# EAGLE board TMCM-1110_V21_eagle (EAGLE 6.5.0)
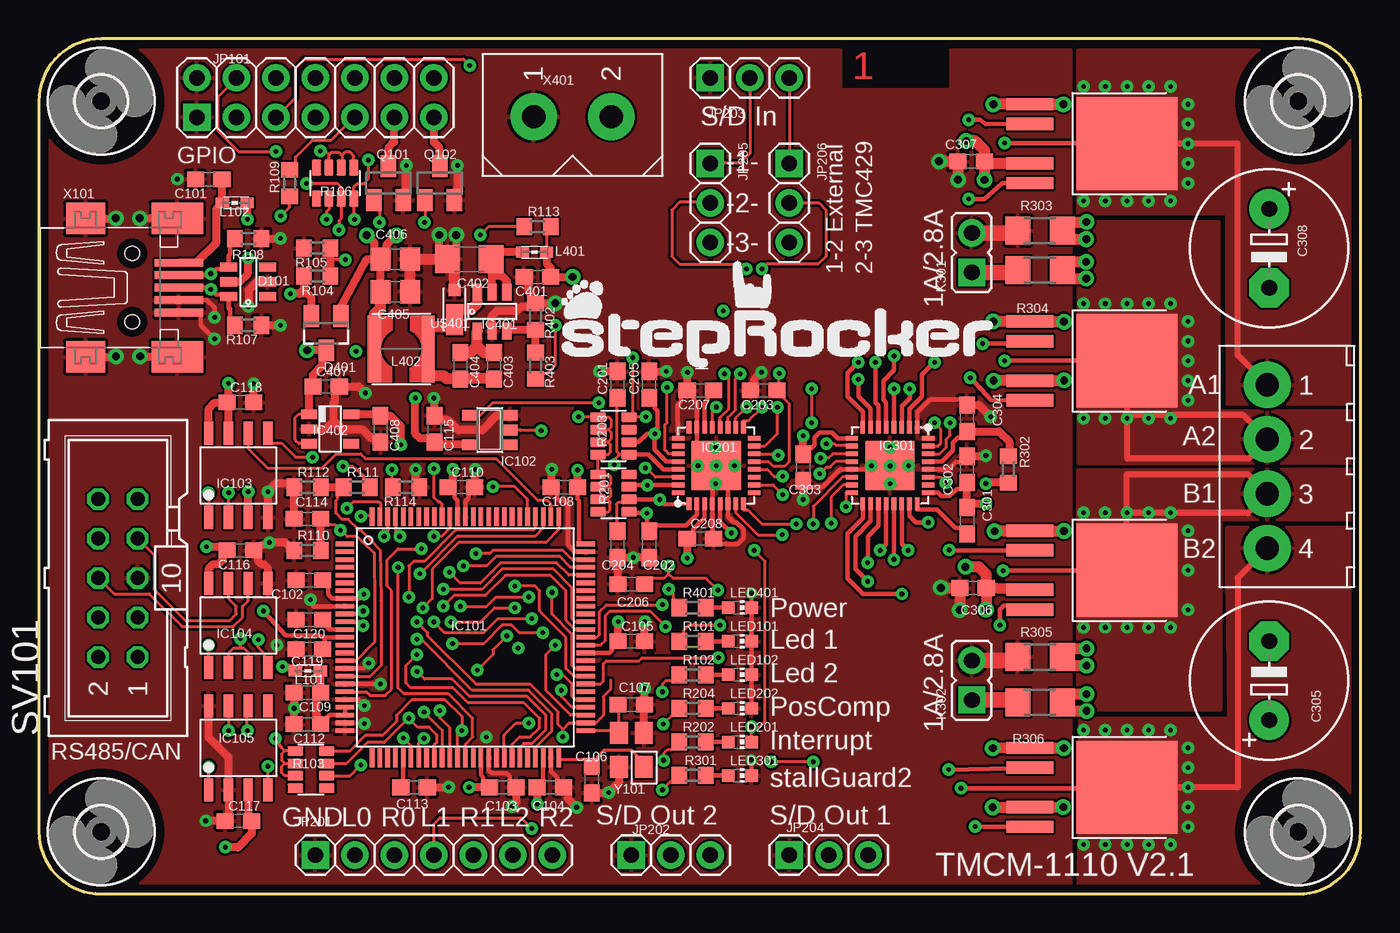
[diagram p4: board, top side]
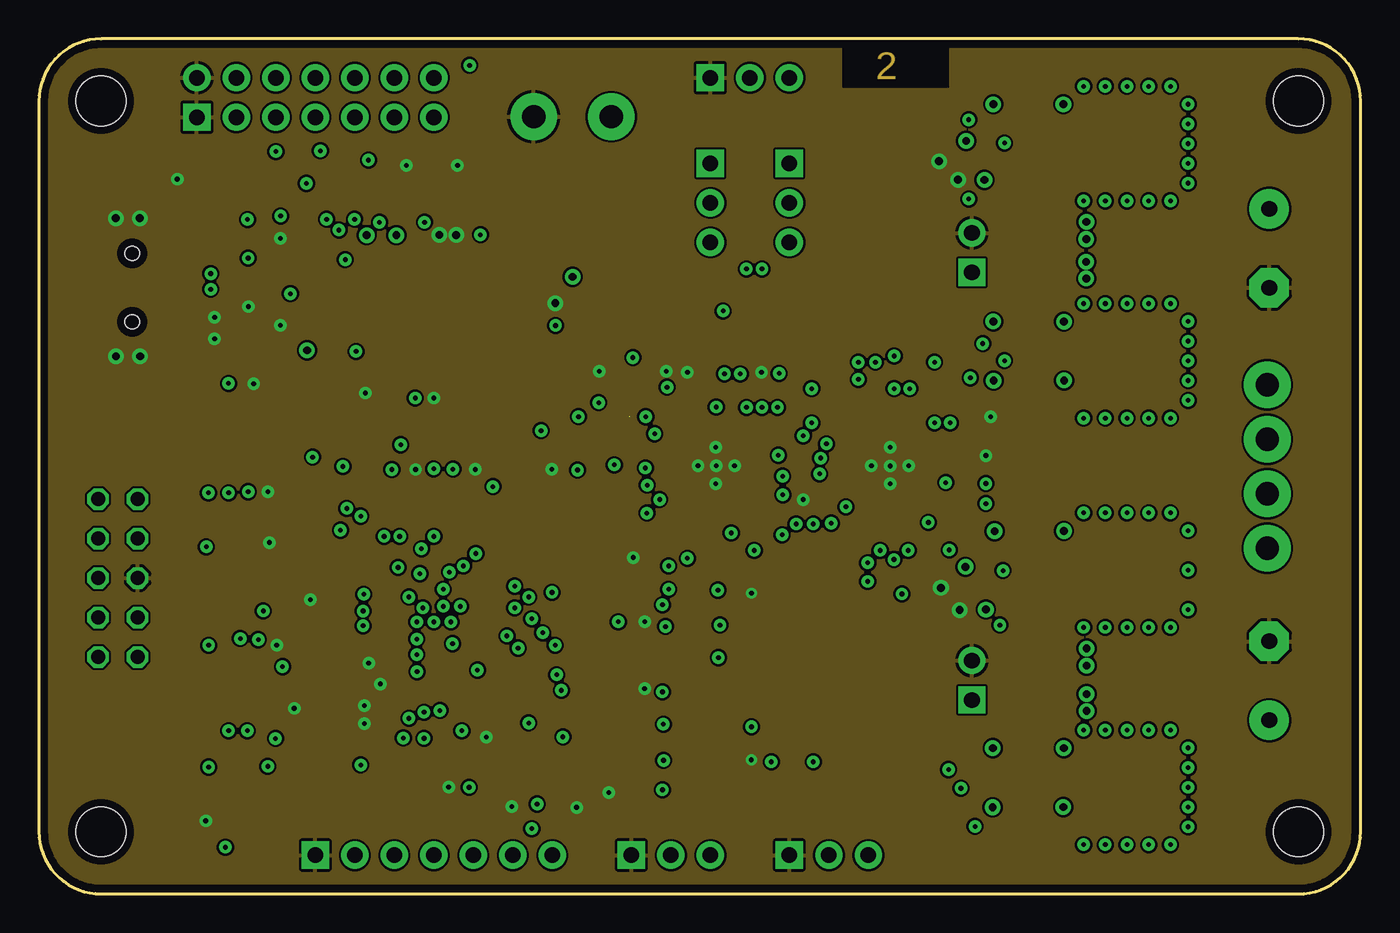
[diagram p5: board, inner layer Layer2]
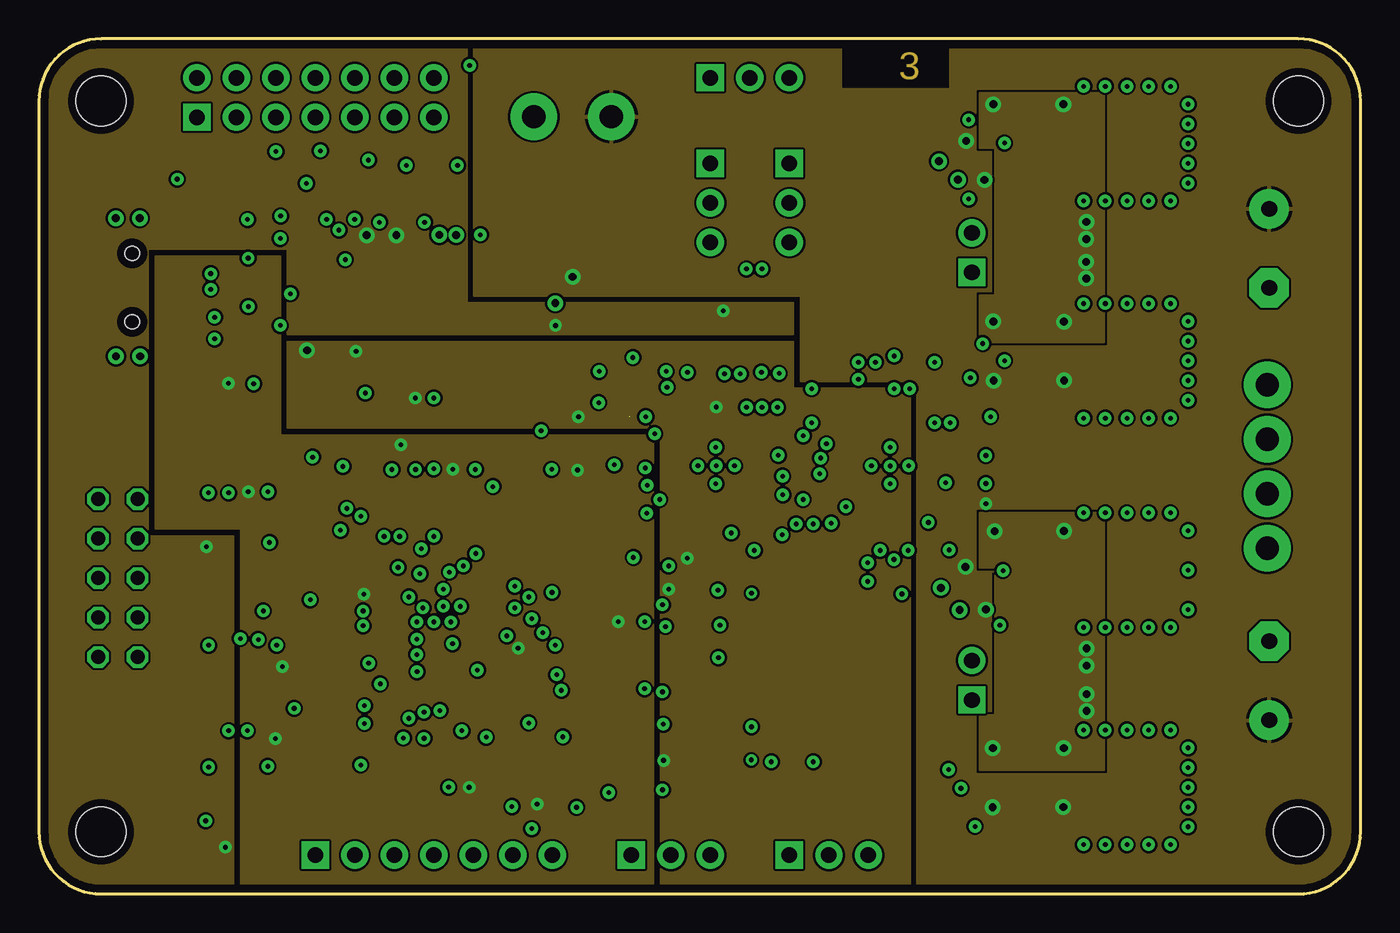
[diagram p6: board, inner layer Route15]
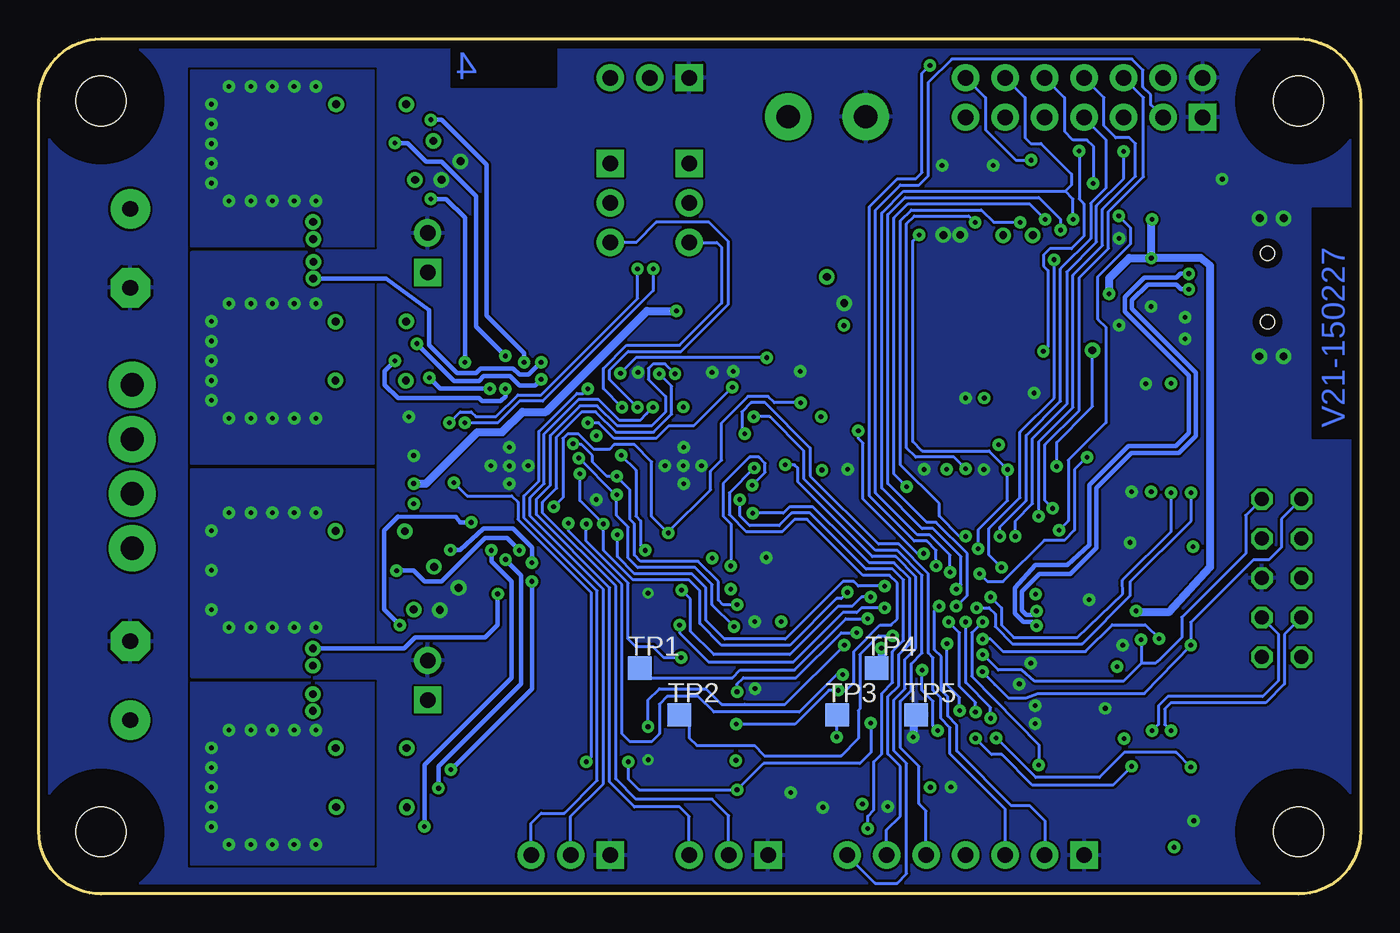
[diagram p7: board, bottom side, seen from below]

Size 85 x 55 mm. Coordinates in mm from the lower left corner, seen from the top.
Outline: 0,51 0,4 arc90 4,0 81,0 arc90 85,4 85,51 arc90 81,55 4,55 arc90 0,51
Copper layers ((1+2)*(15+16)): Top 0.035mm / dielectric 0.36mm / Layer2 0.035mm / dielectric 0.71mm / Route15 0.035mm / dielectric 0.36mm / Bottom 0.035mm
Design rules "default": minimum track width 0.15mm, minimum drill 0.3mm, track to track 0.15mm, track to pad 0.15mm, pad to pad 0.15mm, via to via 0.15mm, smd to smd 0.15mm, copper to edge 0.5mm, drill to drill 0.3mm, minimum pad ring 0.15mm, minimum via ring 0.2mm, stop-mask expansion 0mil, vias tented up to drill 0.5mm, thermal gap 0.2mm
Net classes: 0 default: clearance 0.15 mm

## Footprints (pad centres in the part's own frame; a part is rotated, then mirrored left to right if it is on the bottom)
C0603 = smd 1.1 x 1: 1 -0.85,0; 2 0.85,0
0603 = smd 1.1 x 1: 1 -0.85,0; 2 0.85,0
E5-10,5 = drill 1.016 pad 2.54: + -2.54,0 | drill 1.016 pad 2.54 octagon: - 2.54,0
C1206 = smd 1.6 x 1.8: 1 -1.4,0; 2 1.4,0
C0805 = smd 1.3 x 1.5: 1 -0.95,0; 2 0.95,0
TMC_SOT23-6 = smd 0.6 x 1.1: 1 -0.95,-1.25; 2 0,-1.25; 3 0.95,-1.25; 4 0.95,1.25; 5 0,1.25; 6 -0.95,1.25
SOT23 = smd 1 x 1.4: 1 -0.95,-1.1; 2 0.95,-1.1; 3 0,1.1
3,2 = hole 3.2: 0,0
TMC_LQFP100 = smd 0.3 x 1.2: 1 -6,-7.75; 2 -5.5,-7.75; 3 -5,-7.75; 4 -4.5,-7.75; 5 -4,-7.75; 6 -3.5,-7.75; 7 -3,-7.75; 8 -2.5,-7.75; 9 -2,-7.75; 10 -1.5,-7.75; 11 -1,-7.75; 12 -0.5,-7.75; 13 0,-7.75; 14 0.5,-7.75; 15 1,-7.75; 16 1.5,-7.75; 17 2,-7.75; 18 2.5,-7.75; 19 3,-7.75; 20 3.5,-7.75; 21 4,-7.75; 22 4.5,-7.75; 23 5,-7.75; 24 5.5,-7.75; 25 6,-7.75; 51 6,7.75; 52 5.5,7.75; 53 5,7.75; 54 4.5,7.75; 55 4,7.75; 56 3.5,7.75; 57 3,7.75; 58 2.5,7.75; 59 2,7.75; 60 1.5,7.75; 61 1,7.75; 62 0.5,7.75; 63 0,7.75; 64 -0.5,7.75; 65 -1,7.75; 66 -1.5,7.75; 67 -2,7.75; 68 -2.5,7.75; 69 -3,7.75; 70 -3.5,7.75; 71 -4,7.75; 72 -4.5,7.75; 73 -5,7.75; 74 -5.5,7.75; 75 -6,7.75 | smd 1.2 x 0.3: 26 7.75,-6; 27 7.75,-5.5; 28 7.75,-5; 29 7.75,-4.5; 30 7.75,-4; 31 7.75,-3.5; 32 7.75,-3; 33 7.75,-2.5; 34 7.75,-2; 35 7.75,-1.5; 36 7.75,-1; 37 7.75,-0.5; 38 7.75,0; 39 7.75,0.5; 40 7.75,1; 41 7.75,1.5; 42 7.75,2; 43 7.75,2.5; 44 7.75,3; 45 7.75,3.5; 46 7.75,4; 47 7.75,4.5; 48 7.75,5; 49 7.75,5.5; 50 7.75,6; 78 -7.75,5; 79 -7.75,4.5; 80 -7.75,4; 81 -7.75,3.5; 82 -7.75,3; 83 -7.75,2.5; 84 -7.75,2; 85 -7.75,1.5; 86 -7.75,1; 87 -7.75,0.5; 88 -7.75,0; 89 -7.75,-0.5; 90 -7.75,-1; 91 -7.75,-1.5; 92 -7.75,-2; 93 -7.75,-2.5; 94 -7.75,-3; 95 -7.75,-3.5; 96 -7.75,-4; 97 -7.75,-4.5; 98 -7.75,-5; 99 -7.75,-5.5; 100 -7.75,-6 | smd 1.2 x 0.29: 76 -7.75,6; 77 -7.75,5.5
SOT23-5 = smd 0.69 x 0.99: 1 -0.95,-1.29; 2 0,-1.29; 3 0.95,-1.29; 4 0.95,1.3; 5 -0.95,1.3
SO8 = smd 1.5 x 0.6: 1 -2.7,1.905; 2 -2.7,0.635; 3 -2.7,-0.635; 4 -2.7,-1.905; 5 2.7,-1.905; 6 2.7,-0.635; 7 2.7,0.635; 8 2.7,1.905
QFN32_5X5 = smd 0.8 x 0.3: 1 -2.45,1.75; 2 -2.45,1.25; 3 -2.45,0.75; 4 -2.45,0.25; 5 -2.45,-0.25; 6 -2.45,-0.75; 7 -2.45,-1.25; 8 -2.45,-1.75; 17 2.45,-1.75; 18 2.45,-1.25; 19 2.45,-0.75; 20 2.45,-0.25; 21 2.45,0.25; 22 2.45,0.75; 23 2.45,1.25; 24 2.45,1.75 | smd 0.3 x 0.8: 9 -1.75,-2.45; 10 -1.25,-2.45; 11 -0.75,-2.45; 12 -0.25,-2.45; 13 0.25,-2.45; 14 0.75,-2.45; 15 1.25,-2.45; 16 1.75,-2.45; 25 1.75,2.45; 26 1.25,2.45; 27 0.75,2.45; 28 0.25,2.45; 29 -0.25,2.45; 30 -0.75,2.45; 31 -1.25,2.45; 32 -1.75,2.45 | smd 3.2 x 3.2: EXP 0,0
SOT23-5' = smd 0.6 x 1.05: 1 -0.95,-1.35; 2 0,-1.35; 3 0.95,-1.35; 4 0.95,1.35; 5 -0.95,1.35
2X07 = drill 1 pad 1.75 square: 1 -7.62,-1.27 | drill 1 pad 1.75: 2 -7.62,1.27; 3 -5.08,-1.27; 4 -5.08,1.27; 5 -2.54,-1.27; 6 -2.54,1.27; 7 0,-1.27; 8 0,1.27; 9 2.54,-1.27; 10 2.54,1.27; 11 5.08,-1.27; 12 5.08,1.27; 13 7.62,-1.27; 14 7.62,1.27
1X07 = drill 1 pad 1.75 square: 1 -7.62,0 | drill 1 pad 1.75: 2 -5.08,0; 3 -2.54,0; 4 0,0; 5 2.54,0; 6 5.08,0; 7 7.62,0
1X03 = drill 1 pad 1.75 square: 1 -2.54,0 | drill 1 pad 1.75: 2 0,0; 3 2.54,0
JP1 = drill 1 pad 1.75 square: 1 0,-1.27 | drill 1 pad 1.75: 2 0,1.27
0603' = smd 0.85 x 0.7: 1 -0.9,0; 2 0.7,0
0603'' = smd 0.85 x 0.7: 1 -0.775,0; 2 0.775,0
WE-TPC_3816 = smd 0.85 x 4.3: 1 -1.731,0; 2 1.731,0
CHIP-LED0603 = smd 0.8 x 0.8: A 0,-0.75; C 0,0.75
R0603 = smd 1 x 1.1: 1 -0.85,0; 2 0.85,0
R_4X_1206 = smd 0.6 x 1: P$1 -1.2,-1; P$2 -0.4,-1; P$3 0.4,-1; P$4 1.2,-1; P$5 1.2,1; P$6 0.4,1; P$7 -0.4,1; P$8 -1.2,1
R1206 = smd 1.6 x 1.803: 1 -1.422,0; 2 1.422,0
ML10 = drill 0.914 octagon: 1 -5.08,-1.27; 2 -5.08,1.27; 3 -2.54,-1.27; 4 -2.54,1.27; 5 0,-1.27; 6 0,1.27; 7 2.54,-1.27; 8 2.54,1.27; 9 5.08,-1.27; 10 5.08,1.27
DUAL_DPAK_4L = smd 3 x 0.8: 1 -6.25,2.54; 2 -6.25,1.27; 4 -6.25,-1.27; 5 -6.25,-2.54 | smd 6.5 x 6: 3 0,0
TP15SQ = smd 1.5 x 1.5: TP 0,0
MICRO_SMP = smd 0.8 x 0.8: A 1.25,0 | smd 2 x 1.1: C -0.65,0
32005-301 = smd 3.1 x 0.5: 1 3,1.6; 2 3,0.8; 3 3,0; 4 3,-0.8; 5 3,-1.6 | smd 2.5 x 2: M1 -3,-4.45; M2 -3,4.45 | smd 3.3 x 2: M3 2.9,4.45; M4 2.9,-4.45 | hole 0.9: 0,2.2; 0,-2.2
RIACONNECT_183-04 = drill 1.5 pad 3: 1 0,5.25; 2 0,1.75; 3 0,-1.75; 4 0,-5.25
RIACONNECT_320-02 = drill 1.5 pad 3: 1 0,2.5; 2 0,-2.5
MYLIB_FA-238 = smd 1.4 x 1.15: 1 -1.1,-0.8; 2 1.1,-0.8; 3 1.1,0.8; 4 -1.1,0.8

## Placement (x,y rotation side)
C101  10nF/16V  [C0603]  10.92,45.97 180 top
C102  100nF/50V  [C0603]  17.4,20.19 180 top
C103  100nF/50V  [C0603]  29.84,6.86 0 top
C104  100nF/50V  [C0603]  32.89,6.86 0 top
C105  100nF/50V  [C0603]  38.1,16.26 0 top
C106  0603/15p/10v  [0603]  35.56,7.37 90 top
C107  0603/15p/10v  [0603]  38.1,12.19 180 top
C108  100nF/50V  [C0603]  33.78,26.16 180 top
C109  2.2µF/10V  [C0603]  17.27,12.95 180 top
C110  100nF/50V  [C0603]  27.18,26.16 0 top
C112  100nF/16V  [C0603]  17.27,10.92 180 top
C113  100nF/50V  [C0603]  24.13,6.86 0 top
C114  100nF/16V  [C0603]  17.27,24.13 180 top
C115  100nF/50V  [C0603]  25.45,29.91 270 top
C116  100nF/50V  [C0603]  12.95,22.1 180 top
C117  100nF/50V  [C0603]  12.83,4.7 0 top
C118  100nF/50V  [C0603]  12.95,31.62 0 top
C119  2.2µF/10V  [C0603]  17.4,15.75 180 top
C120  2.2µF/10V  [C0603]  17.4,17.65 180 top
C201  100nF  [C0603]  37.21,32.77 90 top
C202  100nF  [C0603]  39.24,22.48 270 top
C203  100nF  [C0603]  46.61,32.38 180 top
C204  100nF  [C0603]  37.21,22.48 270 top
C205  100nF  [C0603]  39.24,32.77 90 top
C206  100nF  [C0603]  38.1,19.94 180 top
C207  470nF  [C0603]  42.55,32.38 180 top
C208  100nF  [C0603]  42.55,22.86 0 top
C301  220nF 16V  [C0603]  59.69,24 270 top
C302  100nF 50V  [C0603]  59.69,27.3 90 top
C303  470nF 16V  [C0603]  49.15,27.43 270 top
C304  100nF 50V  [C0603]  59.69,30.61 90 top
C305  220µF 50V  [E5-10,5]  79.12,13.72 90 top
C306  100nF 50V  [C0603]  60.07,19.68 180 top
C307  100nF 50V  [C0603]  59.94,47.12 180 top
C308  220µF 50V  [E5-10,5]  79.12,41.53 270 top
C401  100nF/50V  [C0603]  32.07,39.69 180 top
C402  2.2µF/50V/1206  [C1206]  27.69,40.83 180 top
C403  100nF/16V  [C0603]  29.27,33.97 270 top
C404  100nF/16V  [C0603]  27.11,33.97 270 top
C405  22uF/6V3  [C0805]  22.92,38.73 0 top
C406  22uF/6V3  [C0805]  22.92,40.83 0 top
C407  4.7µF/10V  [C0603]  18.48,32.64 0 top
C408  4.7µF/10V  [C0603]  21.97,29.91 270 top
D101  SRV05-4  [TMC_SOT23-6]  13.46,39.37 90 top
D401  BAS40-05  [SOT23]  18.48,36.07 180 top
DRILEGEND  [DRILEGEND]  91.45,52.07 0 top  (outside the outline)
H401  MOUNT-HOLE3.2  [3,2]  81,4 0 top
H402  MOUNT-HOLE3.2  [3,2]  81,51 0 top
H403  MOUNT-HOLE3.2  [3,2]  4,51 0 top
H404  MOUNT-HOLE3.2  [3,2]  4,4 0 top
IC101  MK20DX256VLL10  [TMC_LQFP100]  27.43,16.51 270 top
IC102  74AHCT1G14DBV  [SOT23-5]  29,29.84 90 top
IC103  AT25128B  [SO8]  12.83,26.92 90 top
IC104  SN65HVD3082ED  [SO8]  12.83,17.27 90 top
IC105  TJA1050T  [SO8]  12.83,9.4 90 top
IC201  TMC429-LI  [QFN32_5X5]  43.56,27.56 90 top
IC301  TMC262-LA  [QFN32_5X5]  54.74,27.56 270 top
IC401  LM2841YMK  [TMC_SOT23-6]  29.15,37.47 0 top
IC402  LP2985AIM5-3.3  [SOT23-5']  18.73,29.91 270 top
JP101  nv  [2X07]  17.78,51.23 0 top
JP201  nv  [1X07]  25.4,2.5 0 top
JP202  nv  [1X03]  40.64,2.5 0 top
JP203  nv  [1X03]  45.72,52.5 0 top
JP204  nv  [1X03]  50.8,2.5 0 top
JP205  nv  [1X03]  43.18,44.45 270 top
JP206  nv  [1X03]  48.26,44.45 270 top
K301  nv  [JP1]  60,41.25 0 top
K302  nv  [JP1]  60,13.75 0 top
L101  600R/100MHz  [0603']  17.4,14.35 0 top
L102  600R/100MHz  [0603']  12.7,44.45 0 top
L401  600R@100MHz/1A  [0603'']  31.88,41.27 180 top
L402  33uH/0.32A  [WE-TPC_3816]  23.3,35.05 180 top
LED101  yellow  [CHIP-LED0603]  45.09,16.26 270 top
LED102  yellow  [CHIP-LED0603]  45.09,14.1 270 top
LED201  orange  [CHIP-LED0603]  45.09,9.78 270 top
LED202  yellow  [CHIP-LED0603]  45.09,11.94 270 top
LED301  red  [CHIP-LED0603]  45.09,7.62 270 top
LED401  orange  [CHIP-LED0603]  45.09,18.41 270 top
Q101  BSS138  [SOT23]  22.48,45.72 0 top
Q102  BSS138  [SOT23]  25.78,45.72 0 top
R101  680R  [R0603]  42.04,16.26 0 top
R102  680R  [R0603]  42.04,14.1 0 top
R103  4k7  [R_4X_1206]  17.5,8 90 top
R104  10k  [R0603]  17.91,39.75 0 top
R105  43k  [R0603]  17.91,41.53 180 top
R106  1k8  [R_4X_1206]  19.05,45.72 0 top
R107  470k  [R0603]  13.46,36.58 180 top
R108  470k  [R0603]  13.46,42.16 180 top
R109  22k  [R0603]  16.13,45.72 90 top
R110  10k  [R0603]  17.27,22.1 0 top
R111  5k6  [R0603]  20.45,26.16 0 top
R112  10k  [R0603]  17.27,26.16 0 top
R113  82k  [R0603]  32.07,42.93 0 top
R114  10k  [R0603]  23.62,26.16 180 top
R201  4k7  [R_4X_1206]  36.96,25.78 90 top
R202  1K8  [R0603]  42.04,9.78 180 top
R203  4k7  [R_4X_1206]  36.96,29.46 90 top
R204  1K8  [R0603]  42.04,11.94 0 top
R301  1K8  [R0603]  42.04,7.62 0 top
R302  0R  [R0603]  62.36,27.3 270 top
R303  0R220  [R1206]  64.39,42.67 0 top
R304  0R100  [R1206]  64.39,40.13 0 top
R305  0R220  [R1206]  64.39,15.24 0 top
R306  0R100  [R1206]  64.39,12.32 0 top
R401  1K8  [R0603]  42.04,18.41 0 top
R402  4k87  [R0603]  31.94,37.15 270 top
R403  27k  [R0603]  31.94,33.97 270 top
SV101  nv  [ML10]  5.08,20.32 90 top
T301  TMC1620  [DUAL_DPAK_4L]  69.98,48.26 0 top
T302  TMC1620  [DUAL_DPAK_4L]  69.98,34.29 0 top
T303  TMC1620  [DUAL_DPAK_4L]  69.98,20.83 0 top
T304  TMC1620  [DUAL_DPAK_4L]  69.98,6.86 0 top
TP1  TPTP15SQ  [TP15SQ]  46.35,14.52 0 bottom
TP2  TPTP15SQ  [TP15SQ]  43.81,11.52 0 bottom
TP3  TPTP15SQ  [TP15SQ]  33.66,11.52 0 bottom
TP4  TPTP15SQ  [TP15SQ]  31.11,14.52 0 bottom
TP5  TPTP15SQ  [TP15SQ]  28.57,11.52 0 bottom
U$401  MSS1P6  [MICRO_SMP]  26.73,37.59 90 top
X101  MINI-USB-SCHIELD-32005-301  [32005-301]  6,39 0 top
X301  RIACONNECT_183-04  [RIACONNECT_183-04]  79,27.5 0 top
X401  TMC_POWER_CONNECTOR  [RIACONNECT_320-02]  34.32,50 90 top
Y101  16MHZ-3.2X2.5  [MYLIB_FA-238]  38.1,9.27 90 top

## Tracks (layer width: path | path; a pad name or v marks a point on that pad's centre or on a via)
!CS_262  (via drill 0.3 pad 0.8)
  Top 0.2: IC301.14 51.67,26.81 | IC101.57 36.11,13.51 36.3,13.7 36.3,14.8 36.5,15 38.6,15 38.8,15.2 v43.7,15.2 | 51.67,26.81 49.8,24.94 | 49.8,24.94 v49.8,23.8 | 51.67,26.81 49.8,24.94
  Bottom 0.2: v43.7,15.2 44.8,15.2 45.5,15.9 46.6,15.9 47.1,16.4 47.1,20 49.8,22.7 v49.8,23.8
!CS_EEPROM  (via drill 0.3 pad 0.8)
  Top 0.2: IC101.76 33.43,23.43 32.6,22.6 27,22.6 25.3,20.9 25.3,19 v24.7,18.4 | v10.9,25.8 10.92,25.78 IC103.1
  Bottom 0.2: v24.7,18.4 23.9,18.4 23.5,18 23.5,17.2 22.4,16.1 17.9,16.1 14.81,19.19 14.81,20.09 10.9,24 v10.9,25.8
!EN_262  (via drill 0.3 pad 0.8)
  Top 0.2: IC101.55 34.51,12.51 34.5,12.5 34.3,12.7 34.3,13.5 33.7,14.1 v33.3,14.1 | IC301.15 51.71,26.31 50.95,25.55 v50.95,23.85
  Bottom 0.2: v33.3,14.1 33.7,14.1 36.1,11.7 41.6,11.7 42.6,12.7 44.6,12.7 45.1,12.2 45.1,10.3 45.6,9.8 47,9.8 47.5,10.3 47.5,19.9 50.95,23.35 v50.95,23.85
!INT_429  (via drill 0.3 pad 0.8)
  Top 0.2: IC201.14 47.48,28.31 v47.55,28.21 | LED201.C v45.84,10.75 v45.83,10.75 46.35,10.75 46.7,11.1 46.7,21.4 v46,22.1 | IC101.53 34.19,11.51 32.6,13.1 32.6,15.4 v33.2,16
  Bottom 0.2: v45.83,10.75 45.83,12.47 45.1,13.2 42.1,13.2 41.1,12.2 39.6,12.2 37.01,12.2 v33.2,16 | v47.55,28.21 46.6,27.27 46.6,24.3 46.3,24 46.3,22.4 v46,22.1
!SCS_429  (via drill 0.3 pad 0.8)
  Top 0.2: IC201.7 44.81,24.54 46.25,23.1 v47.8,23.1 | IC101.58 34.4,14 33.9,14.5 33.9,16.5 32.2,18.2 32.2,19.5 31.9,19.8 v30.6,19.8
  Bottom 0.2: v30.6,19.8 32.3,19.8 32.6,20.1 33.3,20.1 37,16.4 40.9,16.4 42.1,17.6 42.1,19.7 43,20.6 46.7,20.6 47.8,21.7 v47.8,23.1
+3V3  (via drill 0.3 pad 0.8)
  Top 0.2: R103.P$7 15.8,7.6 15.6,7.8 15.6,8.2 15.8,8.4 | 15.8,8.4 R103.P$6 | R103.P$5 15.8,9.2 | 15.8,9.2 15.6,9 15.6,8.6 15.8,8.4 | 15.8,9.2 15.6,9.4 v15.22,10
  Top 0.3: IC101.89 26.93,25.32 26.74,25.51 26.74,25.75 C110.1 | IC101.61 36.71,15.51 36.87,15.66 36.87,15.87 C105.1 | IC101.48 32.43,7.25 C104.1 | IC101.40 28.43,7.66 28.58,7.51 28.58,7.27 C103.1 | IC101.75 34.74,22.51 34.74,25.29 34.63,25.4 C108.1 | v20.9,19.28 20.63,19.01 IC101.8 18.85,19.01 18.61,19.26 18.61,20.19 C102.1
  Top 0.5: IC402.5 21.87,30.86 C408.1 22.6,30.76 23.27,30.09 v23.27,28.89 | IC103.8 10.92,31.2 11.32,31.6 12.08,31.6 C118.1 12.19,31.54 | L101.1 16.46,14.22 16.32,14.49 15.69,14.63 v15.68,14.62 v15.67,14.62 | IC103.3 v13.46,25.87 | IC103.7 12.19,31.54 | 12.19,31.54 v12.19,32.83 v12.2,32.84 | C110.1 26.63,26.16 v26.63,27.32 | C108.1 v34.64,27.27 | C105.1 v37.25,17.5 v37.26,17.51 | C103.1 v27.67,6.86 | C104.1 v32.04,5.78
  Bottom 0.5: TP4.TP 30.8,14.9 30.8,15.79 v30.82,15.81
  pour Route15 (rank 4): 15.5,29.5 15.5,41 7.5,41 7.5,23.5 13,23.5 13,0.5 39.5,0.5 39.5,29.5
+5V  (via drill 0.3 pad 0.8, 0.5 pad 1)
  Top 0.2: R403.2 31.98,33.16 32.06,33.16 32.4,33.5 32.7,33.5 33.23,34.02 v33.23,36.56
  Top 0.3: R403.2 31.94,33.14
  Top 0.5: C405.1 C406.1 | D401.1 19.43,37.78 21.08,40.83 C406.1 | C406.1 | v10.77,22.33 11.87,22.33 C116.2 11.82,21.82 11.82,21.48 11.56,21.21 11.21,21.21 10.92,20.92 IC104.8 | v12,3 12.8,3 13.69,3.9 C117.2 13.46,4.91 IC105.3 | C406.1 22.37,41.23 22.37,41.77 22.72,42.13 v22.99,42.37 | C406.1 21.59,41.22 21.59,41.87 21.09,42.37 v21.08,42.37 | R302.2 60.9,26.45 v60.9,26.4
  Top 0.7: L402.2 21.57,37.27 21.98,37.67 C405.1
  Bottom 0.5: v60.9,26.4 60.1,26.4 56.8,29.7 55.2,29.7 53.9,31 52.4,31 45.9,37.5 v44,37.5
  pour Route15 (rank 4): 12.5,23 12.5,0.5 4,0.5 arc-90 0.5,4 0.5,50.5 arc-90 4.5,54.5 27.5,54.5 27.5,38 48.5,38 48.5,36 16,36 16,41.5 7,41.5 7,23
+5V/1  (via drill 0.3 pad 0.8, 0.5 pad 1)
  Top 0.2: R201.P$8 36.6,24.58 36.74,24.72 36.74,25.22 36.58,25.38 | 36.58,25.38 R201.P$7 | R201.P$6 36.61,26.18 | 36.61,26.18 36.76,26.04 36.76,25.55 36.58,25.38 | 36.61,26.18 36.77,26.35 36.77,26.83 36.62,26.98 R201.P$5 R203.P$8 36.59,28.26 36.77,28.44 36.77,28.89 36.59,29.07 | 36.59,29.07 R203.P$7 | R203.P$6 36.63,29.86 | 36.63,29.86 36.79,29.7 36.79,29.26 36.59,29.07 | 36.63,29.86 36.8,30.04 36.8,30.51 36.65,30.66 R203.P$5 34.74,30.66 v34.7,30.7 | IC201.21 43.31,31.07 v43.56,31.32 | 41.19,9.84 R202.2 40.7,9.3 40.43,9.3 40.17,9.05 v40.17,8.59 | R401.1 40.8,18.8 40.8,19.3 v40.5,19.6 | R111.2 21.26,26.2 | 21,26.3 21.16,26.3 21.26,26.2 | IC402.3 16.73,28.96 16.49,29.2 16.49,30.65 16.7,30.86 IC402.1 | 21.26,26.2 21.3,26.2 21.2,26.3 21.2,26.6 20.9,26.6 20.9,26.9 20.2,27.5 v19.55,27.5 | 19.5,47.5 19.3,47.7 18.8,47.7 18.65,47.55 | 19.5,47.5 19.5,46.77 R106.P$6 | R106.P$5 20.25,47.45 20,47.7 19.7,47.7 19.5,47.5 | 18.65,47.55 18.4,47.8 v18.1,47.8 | C208.1 41.63,22.8 | R106.P$7 18.65,47.55
  Top 0.3: IC201.3 42.81,24.18 42.06,23.43 42.06,23.23 C208.1
  Top 0.5: IC402.1 17.38,32.39 C407.1 17.63,33.39 18.25,34.01 18.25,34.74 D401.3 v17.24,34.97 v17.25,34.97 | C208.1 v41.7,21.59 | IC102.5 25.45,28.89 25.45,28.95 | 25.45,28.95 C115.2 | 25.45,28.95 25.1,29.3 24.5,29.3 24.2,29.6 v24.2,31.9
  Bottom 0.2: v19.55,27.5 19.55,29.05 17.5,31.1 17.25,31.35 v17.25,34.97 | v18.1,47.8 18.1,44.7 17.8,44.4 17.8,42.3 18.6,41.5 20,41.5 20.4,41.1 20.4,40.4 20.1,40.1 20.1,35.2 v20.4,34.9
  pour Route15 (rank 4): 16,35.5 48.5,35.5 48.5,32.5 56,32.5 56,0.5 40,0.5 40,30 16,30
AIN
  Top 0.2: R109.2 16.16,46.6 16.5,46.6 16.5,47.4 17.6,48.5 18.8,48.5 20.26,49.96 JP101.9
BMA1  (via drill 0.3 pad 0.8)
  Top 0.3: 69.94,48.3 v62.1,48.3 | IC301.5 54.49,31.61 54.3,31.8 54.3,33 55,33.7 v55,34.6
  Top 0.38: X301.1 77.09,34.66 77.09,48.26 v73.91,48.26 T301.3
  Bottom 0.3: v55,34.6 56.9,36.5 56.9,44.9 59.1,47.1 60.1,47.1 61.3,48.3 v62.1,48.3
  other vias: 73.91,45.72 73.91,46.99 73.91,50.8 73.91,49.53 67.18,51.94 72.77,51.94 69.98,51.94 68.58,51.94 71.37,51.94 69.98,44.58 72.77,44.58 71.37,44.58 67.18,44.58 68.58,44.58
  pour Top (rank 4, no thermals): 66.8,43.73 66.8,54.3 80.8,54.3 84.4,50.9 84.5,35.2 76.4,35.2 76.4,43.73
  pour Top (rank 4): 76.4,35.2 76.4,31.5 84.5,31.5 84.5,35.3 76.4,35.3
  pour Bottom: 63.5,52.96 63.5,41.66 75.18,41.66 75.18,52.96
BMA2  (via drill 0.3 pad 0.8)
  Top 0.3: 69.97,34.3 v62.1,34.3 | IC301.4 55,30.06 v55,32.5 | 70,32.9 69.98,32.92 T302.3
  Top 0.38: X301.2 77.45,30.8 70,30.8 | 79,29.2 77.8,28 70,28 70,30.8 | 70,30.8 70,32.9
  Bottom 0.3: v62.1,34.3 62.75,33.65 62.75,32.75 61.91,31.9 56.7,31.9 56.5,31.7 55.3,31.7 55,32 v55,32.5
  other vias: 73.91,34.29 73.91,36.83 73.91,31.75 73.91,33.02 73.91,35.56 72.77,37.97 69.98,37.97 67.18,37.97 68.58,37.97 71.37,37.97 71.37,30.61 72.77,30.61 69.98,30.61 67.18,30.61 68.58,30.61
  pour Top (rank 4, no thermals): 66.8,43.23 66.8,27.7 75.9,27.7 75.9,43.23
  pour Top (rank 4): 75.9,31.1 84.5,31.1 84.5,27.7 75.9,27.7
  pour Bottom: 63.5,41.27 63.5,27.69 75.18,27.69 75.18,41.27
BMB1  (via drill 0.3 pad 0.8)
  Top 0.3: 69.98,20.8 v62,20.8 | IC301.20 54.49,23.37 54.48,23.37 54.48,22.48 v54.1,22.1
  Top 0.38: T303.3 69.98,27 77.75,27 X301.3 77.75,24.5 70,24.5
  Bottom 0.3: v62,20.8 60.9,20.8 60.2,20.1 59.1,20.1 56.3,22.9 54.9,22.9 v54.1,22.1
  other vias: 73.91,20.83 73.91,23.37 73.91,18.29 72.77,24.51 69.98,24.51 67.18,24.51 68.58,24.51 71.37,24.51 69.98,17.14 72.77,17.14 71.37,17.14 67.18,17.14 68.58,17.14
  pour Top (rank 4, no thermals): 66.8,27.3 76,27.3 76,11.8 66.8,11.8
  pour Top (rank 4): 76,27.3 76,24.1 84.5,24.1 84.5,27.3
  pour Bottom: 63.5,27.3 63.5,13.97 75.18,13.97 75.18,27.3
BMB2  (via drill 0.3 pad 0.8)
  Top 0.3: T304.3 69.92,6.8 v59.3,6.8 | IC301.21 v54.99,21.51 v55,21.5
  Top 0.38: X301.4 77.09,20.34 77.09,6.86 v73.91,6.86 | 70.1,6.86 T304.3
  Top 0.406: 70.1,6.86 v73.91,6.86
  Bottom 0.3: v59.3,6.8 59.3,8.2 54,13.5 54,20.5 v55,21.5 v54.99,21.51
  other vias: 73.91,9.4 73.91,4.32 73.91,5.59 73.91,8.13 67.18,10.54 72.77,10.54 69.98,10.54 68.58,10.54 71.37,10.54 71.37,3.17 72.77,3.17 69.98,3.17 68.58,3.17 67.18,3.17
  pour Top (rank 4, no thermals): 84.5,19.8 76.4,19.8 76.5,11.3 66.9,11.3 66.8,0.4 80.9,0.4 84.5,4.1
  pour Top (rank 4): 76.4,19.32 76.4,23.6 84.5,23.6 84.5,19.32
  pour Bottom: 63.5,13.59 63.5,1.91 75.18,1.91 75.18,13.59
CAN_RX  (via drill 0.3 pad 0.8)
  Top 0.2: IC101.32 24.43,9.67 v24.77,10.01 | IC105.4 14.73,8.2 v14.72,8.21
  Bottom 0.2: v24.77,10.01 23.74,8.98 23.08,8.98 21.1,7 15.93,7 v14.72,8.21
CAN_TX  (via drill 0.3 pad 0.8)
  Top 0.2: IC101.31 23.93,9.54 v23.44,10.03 | IC105.1 v10.92,8.16
  Bottom 0.2: v10.92,8.16 11.86,9.1 15.2,9.1 16.8,7.5 20.9,7.5 v23.43,10.03 v23.44,10.03
CANH  (via drill 0.3 pad 0.8)
  Top 0.2: IC105.7 v12.19,10.51 v12.2,10.5
  Bottom 0.2: SV101.4 4.9,16.69 4.9,13.5 6.1,12.3 12.2,12.3 12.6,11.9 12.6,10.9 v12.2,10.5
CANL  (via drill 0.3 pad 0.8)
  Top 0.2: SV101.3 6.27,17.7 | v13.4,10.5 13.4,12.03 IC105.6
  Bottom 0.2: SV101.3 5.3,16.73 5.3,13.7 6.3,12.7 12.4,12.7 13,12.1 13,10.9 v13.4,10.5
CLK_TMC  (via drill 0.3 pad 0.8)
  Top 0.2: IC102.4 28.39,30.8 29.2,31.6 v36,31.6 | IC301.16 52.23,25.8 51.9,25.8 v51.9,24.9
  Top 0.3: IC201.5 43.81,23.94 v44.53,23.22
  Bottom 0.2: v36,31.6 37.7,31.6 38.1,32 39.4,32 41.1,30.3 41.1,27.9 41.8,27.2 41.8,26 44.53,23.27 v44.53,23.22 45.6,24.29 45.6,27.8 46.7,28.9 48,28.9 48.3,28.6 49.3,28.6 50.3,29.6 51,29.6 51.3,29.3 51.3,25.5 v51.9,24.9
DIR1  (via drill 0.3 pad 0.8)
  Top 0.2: IC301.30 57.92,28.31 58.36,28.75 58.36,29.26 58.6,29.5 v58.6,30.3 | JP206.2 50.15,44.45 50.6,44 50.6,41 50.1,40.5 46.8,40.5 v46.5,40.2
  Bottom 0.2: v58.6,30.3 57.9,31 57.2,31 56.9,30.7 55.6,30.7 54.2,32.1 52.7,32.1 46.5,38.3 v46.5,40.2
DIR1_429  (via drill 0.3 pad 0.8)
  Top 0.2: IC201.17 45.31,30.44 45.64,30.44 v46.5,31.3
  Bottom 0.2: 48.3,41.87 JP206.3 46.59,41.91 45.3,43.2 41.9,43.2 40.7,42 40.7,37.9 43.7,34.9 47.1,34.9 48.3,33.7 48.3,33.1 v46.5,31.3
DIR1_EXT
  Top 0.2: JP203.3 JP206.1
DIR2  (via drill 0.3 pad 0.8)
  Top 0.2: IC201.27 40.51,28.31 40.27,28.55 40.27,30.16 40.4,30.3 v40.4,32.6 | v49.7,30.3 v49.7,32.5
  Bottom 0.2: JP204.3 53.34,4.56 52.7,5.2 51.2,5.2 49.1,7.3 49.1,19.5 53.8,24.2 53.8,25.6 52.85,26.55 52.85,29.75 50.4,32.2 50,32.2 v49.7,32.5 | v40.4,32.6 42.9,30.1 44.5,30.1 45.3,29.3 48,29.3 49,30.3 v49.7,30.3
DIR3  (via drill 0.3 pad 0.8)
  Top 0.2: IC201.20 43.81,30.64 44.01,30.84 44.37,31.2 44.37,33.18 v44.09,33.46
  Bottom 0.2: JP202.3 43.18,4.98 43.8,5.6 46.7,5.6 48.3,7.2 48.3,19.7 53,24.4 53,25.4 52.1,26.3 52.1,29.5 50.2,31.4 49.1,31.4 47.8,30.1 45.6,30.1 44.7,31 44.7,32 45.8,33.1 45.8,33.8 45.5,34.1 44.73,34.1 v44.09,33.46
GND  (via drill 0.3 pad 0.7, 0.3 pad 0.8, 0.5 pad 1)
  Top 0.2: Q101.2 23.37,44.56 23.37,44.45 | IC301.1 56.84,30.06 57.2,29.7 57.2,29.35 IC301.32
  Top 0.3: LED202.C LED102.C LED101.C LED401.C v45.84,19.34 v45.83,19.35 | LED301.C 45.84,8.61 v45.82,8.62 | IC101.9 17.65,18.51 | IC101.88 27.43,25.27 27.63,25.47 27.63,25.77 C110.2 | IC101.49 32.93,7.89 33.36,7.46 33.36,7.24 C104.2 | IC101.41 28.93,7.96 29.15,7.75 30.08,7.75 30.3,7.53 30.3,7.25 C103.2 | IC101.74 34.46,22.02 34.03,22.45 34.03,25.07 33.8,25.3 33.47,25.3 33.32,25.45 33.32,26.16 33.3,26.14 32.94,26.14 | IC201.25 41.06,31.45 41.28,31.66 41.28,31.97 C207.2 42.08,32 42.09,31.8 42.32,31.57 IC201.23 42.31,28.81 IC201.EXP | C208.2 43.31,22.94 IC201.4 43.31,27.31 IC201.EXP | IC201.EXP 44.31,26.81 IC201.6 44.31,24.29 44.69,23.91 44.87,23.91 45.31,23.47 45.31,22.87 44.95,22.51 43.71,22.51 43.4,22.82 43.39,22.82 43.36,22.85 | C303.2 49.56,26.17 50.39,26.17 50.88,26.66 50.97,26.75 51.53,27.31 IC301.13 54.49,27.31 IC301.EXP | IC301.28 58.5,27.31 58.96,27.77 59.3,27.77 C302.2 | IC101.21 20.54,12.51 v20.94,12.11 | IC101.19 v21.95,13.51 | IC101.17 20.88,14.51 v21.21,14.84 | IC301.1 56.49,30.99 57.3,31.8 59.35,31.8 C304.2 | X101.4 10.8,38.2 11.3,37.7 v11.3,37.1 | X101.5 10.4,37.4 10.4,36.6 v11.3,35.7
  Top 0.5: IC401.2 29.15,37.21 29.46,37.53 30.77,37.53 31.02,37.77 31.72,37.77 | C401.2 31.22,39.46 31.5,39.18 31.5,38.73 31.66,38.58 31.66,38.28 32.01,37.93 32.06,37.93 31.9,37.77 31.72,37.77 | D101.2 14.01,39.37 13.48,38.84 13.48,37.79 v13.47,37.78 | R108.1 15.41,42.16 v15.52,42.16 | R107.1 15.38,36.58 v15.52,36.57 | IC104.5 14.73,20.94 14.47,21.2 14.32,21.2 14.11,21.42 14.11,21.8 C116.1 14.05,22.34 v14.83,22.6 v14.84,22.61 15.85,22.61 16.36,22.1 R110.1 | v10.73,4.7 v10.74,4.7 C117.1 12.19,4.91 IC105.2 12.19,8.8 10.92,10.07 IC105.8 | v33.22,38 33.08,38 R402.1 31.72,37.77 | C402.2 26.29,40.94 25.75,41.47 v25.75,42.39 | v26.84,42.38 26.83,42.34 26.83,41.33 26.34,40.84 26.37,40.84 26.38,40.84 | C112.2 16.42,12.32 v16.42,11.94 16.42,12.32 C109.2 | IC103.4 v14.73,25.87 14.73,25.93 15.2,26.4 16.18,26.4 R112.1 C114.2 | C118.2 13.8,32.81 v13.81,32.82 | v21,32.22 20.58,32.64 C407.2 19.05,32.36 19.05,31.67 18.94,31.56 18.94,30.43 | IC402.2 18.42,29.91 18.94,30.43 | X101.M2 4.93,43.45 v4.95,43.46 | X101.M1 4.93,34.55 v4.96,34.58 | X101.M4 6.54,34.55 v6.51,34.58 | X101.M3 6.5,43.45 v6.49,43.46 | C110.2 28.07,26.2 v28.07,27.3 | R114.1 24.23,26.16 v24.23,27.3 | C108.2 32.98,26.21 v32.98,27.31 | C303.2 v49.15,25.37 | C207.2 41.71,32.4 v41.71,33.55 | C203.2 46.02,32.65 46.02,33.11 v46.47,33.56 | C205.2 v40.33,33.62 v40.34,33.61 | C201.2 v36.04,33.62 v36.03,33.61 | C202.2 v38.24,21.63 v38.23,21.64 v38.22,21.63 C204.2 37.25,21.59 C206.2 | C105.2 v38.95,17.51 v38.96,17.52 | C104.2 33.74,6.85 34.03,6.56 34.03,6.12 v34.58,5.57 | C106.1 v36.64,6.52 37.3,7.18 Y101.4 | Y101.2 38.9,12.14 C107.1 v38.95,13.2
  Top 0.5: C113.2 26.32,6.86 v26.34,6.88 v26.35,6.87 | C103.2 30.7,5.89 v30.42,5.62 | IC102.3 29.48,30.8 28.52,29.84 26.96,29.84 26.33,30.47 25.74,30.47 C115.1 25.45,31.75 v25.4,31.9 | C408.2 21.68,29.35 21.33,29.35 20.82,29.86 19.53,29.86 18.95,30.43 18.94,30.43 | 23.37,44.45 23.62,44.7 v23.62,46.86 | Q102.2 26.92,44.81 v26.92,46.86 | C304.2 60.44,31.46 v61.2,30.7 | C302.2 60.85,28.16 v60.9,28.2
  Top 0.7: C405.2 C406.2 C402.2 26.73,40.38 U$401.A | C307.2 58.35,47.12 v57.89,47.12 v57.88,47.13 | 59.11,47.1 v59.11,45.94 | v58.02,19.68 v58.01,19.69 59.14,19.69 59.19,19.64 59.22,19.64 59.22,19.57 59.27,19.52 59.27,19.67 59.26,19.68 | C306.2 v59.22,18.28 v59.21,18.27
  Top 1: K302.2 62.75,15.02 R305.1 | K301.2 62.81,42.52 R303.1
  Bottom 0.5: TP5.TP 28.77,11.32 v28.77,10.08
  other vias: 8.9,45.98 15.3,16 54.74,27.53 54.74,26.38 54.74,28.73 53.54,27.53 55.94,27.53 43.56,27.55 44.74,27.53 43.54,28.73 43.54,26.38 42.39,27.53 17.45,18.92 20.94,10.97
  pour Layer2: 0.5,4 arc90 4,0.5 81,0.5 arc90 84.5,4 84.5,51 arc90 81,54.5 4,54.5 arc90 0.5,51
  pour Top (rank 4): 66.4,54.3 4,54.3 0.6,50.9 0.6,3.9 4,0.5 66.4,0.5
  pour Bottom (rank 2): 4,54.3 0.6,50.9 0.6,3.9 4,0.5 7.3,0.5 80.9,0.5 84.5,4.1 84.5,50.7 80.9,54.3
N$1
  Top 0.3: R301.2 LED301.A
N$2
  Top 0.3: IC301.29 58.07,27.81 58.77,28.52 58.77,29.03 59.11,29.37 59.67,29.37 C304.1
  Top 0.5: C304.1 61.74,29.76 62.4,29.1 62.4,28.2 R302.1
N$3  (via drill 0.3 pad 0.8)
  Top 0.3: IC301.9 51.39,29.31 51.02,29.68 50.19,29.68 49.88,29.37 49.88,28.88 49.65,28.64 49.51,28.64 C303.1
  Top 0.5: C303.1 49.15,29.23 v49.15,29.47
N$4
  Top 0.3: IC301.24 56.49,24.73 56.48,24.72 57.76,24.72 58.94,23.54 59.3,23.54 C301.2
N$5  (via drill 0.3 pad 0.8)
  Top 0.3: T301.5 61.95,45.73 60.8,44.7 v59.8,44.7 | IC301.2 55.99,31.19 56.8,32 56.8,33.4 v57.6,34.2
  Bottom 0.3: v57.6,34.2 57.6,43.5 58.8,44.7 v59.8,44.7
N$6  (via drill 0.3 pad 0.8)
  Top 0.3: T302.5 61.22,31.76 v59.9,33.2 | IC301.3 55.5,31.4 56,31.9 v56,32.5
  Bottom 0.3: v56,32.5 59.2,32.5 v59.9,33.2
N$7  (via drill 0.3 pad 0.8)
  Top 0.3: T302.2 63.7,35.4 v60.7,35.4 | IC301.7 53.49,31.21 52.7,32 v52.7,33.1
  Bottom 0.3: v52.7,33.1 53.1,32.7 54.1,32.7 54.7,33.3 56.4,33.3 56.7,33 58.3,33 v60.7,35.4
N$8  (via drill 0.3 pad 0.8)
  Top 0.3: T301.2 60.9,49.53 60.5,49.8 v59.8,49.8 | IC301.6 53.99,31.41 53.8,31.6 v53.8,34.2
  Bottom 0.3: v53.8,34.2 53.8,34.8 56.2,37.2 56.2,46.9 59.1,49.8 v59.8,49.8
N$9  (via drill 0.3 pad 0.8)
  Top 0.3: T303.5 62.05,18.55 61.8,18.3 v61.8,17.3 | IC301.23 55.99,24.31 56.4,23.9 v57.2,23.9
  Bottom 0.3: v61.8,17.3 62.8,18.3 62.8,23.38 61.9,24.28 58.17,24.26 57.91,23.9 v57.2,23.9
N$10  (via drill 0.3 pad 0.8)
  Top 0.3: T304.5 60.73,4.32 v60.2,4.35 | IC301.22 55.49,22.51 v55.9,22.1
  Bottom 0.3: v60.2,4.35 60.2,8.3 54.6,13.9 54.6,20.1 55.9,21.4 v55.9,22.1
N$11  (via drill 0.3 pad 0.8)
  Top 0.3: T303.2 58.58,22.09 v58.55,22.13 | IC301.19 53.99,23.69 53.3,23 v53.3,21.3
  Bottom 0.3: v58.55,22.13 57.9,22.13 56.4,23.5 54.5,23.5 53.3,22.3 v53.3,21.3
N$12  (via drill 0.3 pad 0.8)
  Top 0.3: T304.2 v58.5,8 | IC301.18 53.49,23.99 52.5,23 52.5,20.9 v53.3,20.1
  Bottom 0.3: v58.5,8 53.3,13.2 v53.3,20.1
N$13
  Top 1: K302.1 62.81,12.48 R306.1
N$14
  Top 1: K301.1 62.81,39.98 R304.1
N$15
  Top 0.3: LED202.A R204.2
N$16
  Top 0.3: R202.1 LED201.A
N$17  (via drill 0.3 pad 0.8)
  Top 0.2: IC101.73 34.29,21.51 33.7,22.1 29.2,22.1 29,21.9 v28.1,21.9 | v32.3,29.8 30.97,29.8 30.97,29.84 IC102.2
  Bottom 0.2: v28.1,21.9 28.5,21.9 32,25.4 32,29 32.3,29.3 v32.3,29.8
N$18  (via drill 0.3 pad 0.8)
  Top 0.2: IC101.38 27.43,9.63 27.9,10.1 27.9,11.3 26.3,12.9 23.44,12.9 23.1,13.24 v23.1,21 | 18.76,41.19 R105.1 | v19.7,40.8 18.79,40.8 18.76,40.77
  Top 0.5: R104.2 18.76,40.77 R105.1
  Bottom 0.2: v19.7,40.8 19.7,31.9 21.9,29.7 21.9,25.5 23.9,23.5 23.9,21.8 v23.1,21
N$19
  Top 0.5: Q101.3 22.5,46.84 22.5,48.02 22.86,48.38 JP101.11
N$20  (via drill 0.3 pad 0.8)
  Top 0.2: v24.77,11.69 25.93,10.53 IC101.35 | v26.5,17.5 28.4,17.5 29.3,18.4 v30.6,18.4 | 41.5,16.3 41.46,16.26 R101.1 41.19,16.39 41.5,16.7 41.5,17 41.8,17.3 v43.8,17.3
  Bottom 0.2: v24.77,11.69 24.77,12.31 25.8,13.34 25.8,16.8 v26.5,17.5 | v30.6,18.4 32.1,18.4 32.4,18.1 33.3,18.1 36.5,14.9 41.9,14.9 43.8,16.8 v43.8,17.3
N$21  (via drill 0.3 pad 0.8)
  Top 0.3: X101.3 10.95,39 v11.05,38.9 11.4,38.55 12.08,38.55 D101.6 12.21,37.65 12.3,37.65 12.3,36.58 R107.2 | v20.85,18.2 20.66,18.01 IC101.10
  Bottom 0.3: v11.05,38.9 11.55,38.9 11.85,39.2 13.7,39.2 14.7,38.2 14.7,37.65 10.6,33.55 10.6,29.45 11.7,28.35 14.75,28.35 17,26.1 17,22.25 18.66,20.59 20.66,20.59 21.8,19.45 21.8,18.25 21.5,17.95 21.1,17.95 v20.85,18.2
N$22  (via drill 0.3 pad 0.8)
  Top 0.3: X101.2 10.95,39.8 v11.05,39.9 11.4,40.2 12.09,40.2 D101.4 12.21,41.06 12.3,41.15 12.3,41.85 R108.2 | IC101.11 19.69,17.5 20.6,17.5 v20.85,17.25
  Bottom 0.3: v11.05,39.9 11.6,39.9 11.85,39.65 13.9,39.65 15.15,38.4 15.15,37.45 11.05,33.35 11.05,29.65 11.9,28.8 14.95,28.8 17.45,26.3 17.45,22.45 18.86,21.16 20.91,21.16 22.25,19.7 22.25,18.05 21.7,17.5 21.1,17.5 v20.85,17.25
N$23
  Top 0.3: R101.2 LED101.A
N$24
  Top 0.3: R102.2 LED102.A
N$25
  Top 0.3: 18.17,11.3 C112.1 18.71,11.51 IC101.23 IC101.22
  Top 0.5: C112.1 17.82,11.6 17.82,12.99 18.12,13.29 C109.1 18.12,14.07 L101.2
N$26  (via drill 0.3 pad 0.8)
  Top 0.2: IC101.36 26.43,10.68 25.79,11.32 v25.79,11.8 | R102.1 41.19,14.09 40.8,13.7 40.3,13.7 40.1,13.5 v40.1,13 | v32.4,16.8 30.9,16.8 30.4,17.3 29.8,17.3 28.6,16.1 v26.6,16.1
  Bottom 0.2: v26.6,16.1 26.6,13.44 25.79,12.63 v25.79,11.8 | v40.1,13 40.1,13.5 39.7,13.9 36.3,13.9 33.4,16.8 v32.4,16.8
N$27  (via drill 0.3 pad 0.8)
  Top 0.2: 20.38,15.01 IC101.16 19.69,15 20.4,15 21.6,16.2 21.6,18.6 21.56,21.94 20.8,22.66 20.48,22.98 19.82,22.98 v19.4,23.4 19.06,23.74 18.52,23.74 C114.1 | v15.55,43.61 16.13,44.19 R109.1
  Top 0.5: R110.2 C114.1
  Bottom 0.2: v15.55,43.61 14.8,42.85 14.8,41.8 16.89,39.71 16.89,36.96 16.38,36.45 16.38,30.32 18.8,27.9 18.8,24 v19.4,23.4
N$28
  Top 0.3: IC101.30 23.43,7.01 C113.1
N$29
  Top 0.2: IC101.50 33.43,8.65 35.13,8.65 C106.2 35.92,8.58 35.92,8.83 36.32,9.23 38.13,9.23 38.44,8.92 38.44,8.73 38.9,8.27 Y101.1
N$30
  Top 0.5: X101.1 10.12,40.6 11.43,41.91 11.43,44.08 L102.1 11.8,45.95 C101.1
N$31
  Top 0.2: IC101.51 37.16,10.51 Y101.3 37.3,12.14 C107.2
N$32
  Top 0.2: IC101.18 21.31,14.01 22,14.7 22,18.9 21.93,22.14 21.3,22.8 20.7,23.4 20.6,23.4 19.9,24.1 19.5,24.1 19.1,24.5 19.1,25.3 19.2,25.4 19.2,25.77 R111.1 | R112.2 18.45,26.49
  Top 0.5: R112.2 R111.1
N$33  (via drill 0.3 pad 0.8)
  Top 0.2: IC101.20 21.05,13.01 21.3,12.76 22.28,12.76 22.68,13.16 22.68,19.52 22.4,19.8 22.4,21.5 23.1,22.2 v24.6,22.2 | R114.2 22.7,26.23 v22.7,27.3 | R113.1 28.93,42.93 v28.4,42.4
  Bottom 0.2: v28.4,42.4 28.8,42 28.8,29.1 28.2,28.5 23.9,28.5 v22.7,27.3 22.7,25.3 24.6,23.4 v24.6,22.2
N$34
  Top 0.7: C404.1 27.76,34.82 28.19,35.25 | 28.19,35.25 28.19,36.2 IC401.1 | C403.1 28.61,34.82 28.19,35.25
N$35
  Top 0.5: IC401.6 28.2,37.98
  Top 0.7: 28.2,37.98 27.8,37.58 26.76,37.58 26.73,37.56 U$401.C 26.73,36.47 26.72,36.45 25.04,36.45 L402.1 25.03,33.3 25.05,33.32 26.05,33.32 26.25,33.12 C404.2 27.11,33.16 28.84,33.16 28.84,33.12 C403.2
N$36
  Top 0.5: Q102.3 25.77,46.84 25.77,47.99 25.4,48.35 JP101.13
N$37
  Top 0.5: IC401.5 29.15,39.9 | 29.15,39.9 29.15,40.77 C402.1 29.53,41.27 L401.2 | IC401.4 30.1,39.42 29.77,39.75 29.3,39.75 29.15,39.9
N$38
  Top 0.3: LED401.A R401.2
N$40
  Top 0.5: IC401.3 30.18,36.3 R402.2 R403.1
N$42
  cutout Bottom (rank 4): 0.6,44.1 3.1,44.1 3.1,29.3 0.6,29.3
N$43
  cutout Bottom (rank 4): 51.7,54.5 58.5,54.5 58.5,51.9 51.7,51.9
  cutout Route15 (rank 4): 51.7,54.5 58.5,54.5 58.5,51.9 51.7,51.9
  cutout Layer2 (rank 4): 51.7,54.5 58.5,54.5 58.5,51.9 51.7,51.9
  cutout Top (rank 4): 51.7,54.5 58.5,54.5 58.5,51.9 51.7,51.9
N$45
  Top 0.3: IC101.12 18.68,17.01 18.54,17.14 18.54,17.36 C120.1
OPENDRAIN_1  (via drill 0.3 pad 0.8)
  Top 0.2: IC101.90 26.43,23.53 25.9,23 v25.4,23 | Q101.1 21.9,44.25 v21.9,43.2
  Bottom 0.2: v25.4,23 25.8,23 27.1,24.3 27.1,25.1 29.6,27.6 29.6,43.3 28.9,44 24.4,44 23.6,43.2 v21.9,43.2
OPENDRAIN_2  (via drill 0.3 pad 0.8)
  Top 0.2: IC101.91 25.93,25.07 25.8,25.2 25.7,25.2 25.4,25.5 v25.4,27.33 v25.39,27.34 | Q102.1 24.83,43.23 v24.8,43.2
  Bottom 0.2: v25.39,27.34 26.15,28.1 28.6,28.1 29.2,28.7 29.2,43.1 28.7,43.6 25.2,43.6 v24.8,43.2
PHASE_A  (via drill 0.3 pad 0.8)
  Top 0.2: IC101.64 34.49,17.01 33.9,17.6 33.9,19.5 32.9,20.5 30,20.5 28.7,19.2 26.7,19.2 v26,18.5 | v19.3,42.7 19.3,43.3 19.45,43.45 R106.P$3 19.45,45.45 19.2,45.7 v17.2,45.7
  Bottom 0.2: v26,18.5 25.3,19.2 25.3,21.9 27.3,23.9 27.9,23.9 30.4,26.4 30.4,43.7 29.3,44.8 20.7,44.8 19.3,43.4 v19.3,42.7 | JP101.10 19.05,51.23 19.05,49.05 18.5,48.5 17.6,48.5 17.2,48.1 v17.2,45.7
PHASE_B  (via drill 0.3 pad 0.8)
  Top 0.2: IC101.65 34.49,17.51 34.3,17.7 34.3,19.7 33.1,20.9 29.8,20.9 28.5,19.6 v26,19.6 | R106.P$2 18.65,44.05 18.5,43.9 v18.5,43.4
  Bottom 0.2: v26,19.6 25.7,19.9 25.7,21.7 27.5,23.5 28.2,23.5 30.8,26.1 30.8,43.8 29.4,45.2 19,45.2 | JP101.12 21.59,51.23 21.59,48.64 21.21,48.26 20.56,48.26 18.6,46.3 18.6,45.6 19,45.2 | v18.5,43.4 18.5,44.7 19,45.2
PHASE_Z  (via drill 0.3 pad 0.8)
  Top 0.2: IC101.80 31.43,25.37 30.6,26.2 v29.2,26.2 | v20.3,43.4 20.25,43.45 R106.P$4 20.25,45.45 20.5,45.7 20.9,45.7 21.2,46 v21.2,47.2
  Bottom 0.2: v29.2,26.2 30,27 30,43.5 29.1,44.4 21.3,44.4 v20.3,43.4 | JP101.14 24.13,51.23 24.13,49.15 22.18,47.2 v21.2,47.2
POSCOMP  (via drill 0.3 pad 0.8)
  Top 0.2: IC201.30 39.65,26.81 39.05,27.4 v39,27.4 | 41.19,11.96 R204.1 40.8,11.55 40.8,11.5 40.7,11.5 40.16,10.96 v40.16,10.92 | IC101.54 34.29,12.01 33.6,12.7 v33.6,13.1
  Bottom 0.2: v40.16,10.92 36.38,10.92 34.2,13.1 v33.6,13.1 33.1,13.1 32.6,13.6 32.6,15.6 30.9,17.3 30.2,17.3 29.8,17.7 29.8,20 30.3,20.5 32,20.5 35.6,24.1 36.4,24.1 37.2,23.3 39.5,23.3 40.6,24.4 40.6,25.8 v39,27.4
PWM_D0  (via drill 0.3 pad 0.8)
  Top 0.2: IC101.71 34.09,20.51 33.3,21.3 29.7,21.3 28.4,20 27.1,20 v26.4,20.7
  Bottom 0.2: v26.4,20.7 26.4,21.8 27.7,23.1 28.5,23.1 31.2,25.8 31.2,44 29.6,45.6 28.4,45.6 27.8,46.2 27.8,52.2 26.3,53.7 14.7,53.7 14,53 14,51.9 13.5,51.4 13.5,50.76 JP101.3
PWM_D1  (via drill 0.3 pad 0.8)
  Top 0.2: IC101.72 34.19,21.01 33.5,21.7 29.4,21.7 28.8,21.1 v27.3,21.1 | JP101.5 16.5,51.22 16.5,53.1 17.1,53.7 27.3,53.7 v27.7,53.3
  Bottom 0.2: v27.3,21.1 27.3,22.1 27.9,22.7 28.7,22.7 31.6,25.6 31.6,44.2 29.8,46 28.6,46 28.2,46.4 28.2,52.8 v27.7,53.3
PWM_D2  (via drill 0.3 pad 0.8)
  Top 0.2: IC101.97 22.93,23.27 v23.2,23
  Bottom 0.2: v23.2,23 23.2,23.6 21.5,25.3 21.5,29.5 19.3,31.7 19.3,40.22 17.36,42.16 17.36,44.42 16.38,45.4 16.38,48.51 17.78,49.91 JP101.7
PWM_U0  (via drill 0.3 pad 0.8)
  Top 0.2: IC101.98 22.43,23.23 v22.2,23 | JP101.4 12.7,52.45 11.5,51.25 11.5,49.1 12.85,47.75 v15.24,47.75
  Bottom 0.2: v22.2,23 22.2,24 21.1,25.1 21.1,29.3 18.9,31.5 18.9,40.01 16.98,41.93 16.98,44.27 15.24,46.01 v15.24,47.75
PWM_U1  (via drill 0.3 pad 0.8)
  Top 0.2: IC101.99 22,24.29 22,25.1 21.8,25.2 20.2,25.2 v19.8,24.8
  Bottom 0.2: v19.8,24.8 20.3,25.3 20.3,28.9 18.1,31.1 18.1,39.64 16.22,41.52 16.22,43.89 13.97,46.14 13.97,51.23 JP101.6
PWM_U2  (via drill 0.3 pad 0.8)
  Top 0.2: IC101.100 21.39,24.3 v20.7,24.3
  Bottom 0.2: v20.7,24.3 20.7,29.1 18.5,31.3 18.5,39.8 16.6,41.7 16.6,44.04 14.48,46.16 14.48,48.26 14.86,48.64 15.75,48.64 16.51,49.4 16.51,51.23 JP101.8
REF1  (via drill 0.3 pad 0.8)
  Top 0.2: v27.1,18.5 28.8,18.5 29.4,19.1 v31.5,19.1 | 39.29,19.6 C206.1 39.06,19.94 39.1,19.9 39.1,20 39.4,20.3 40.2,20.3 40.5,20.6 | v43.67,19.54 42.91,20.3 40.8,20.3 40.5,20.6 | v40.5,21.1 40.5,20.6
  Top 0.3: IC201.31 41.05,26.3 v39.12,26.3 38.08,26.3 R201.P$3
  Bottom 0.2: JP201.2 20.32,4.72 21.3,5.7 22.48,5.7 25.97,9.19 25.97,10.86 26.55,11.44 26.55,12.68 26.97,13.1 26.97,15.27 27.4,15.7 27.4,18.2 v27.1,18.5 | v31.5,19.1 32.1,19.1 32.7,18.5 33.6,18.5 36.7,15.4 41.6,15.4 43.1,16.9 43.1,18.97 v43.67,19.54 | v39.12,26.3 38.3,27.12 38.3,27.7 38.7,28.1 39.3,28.1 41,26.4 41,24.3 40.5,23.8 v40.5,21.1
REF2  (via drill 0.3 pad 0.8)
  Top 0.2: R201.P$2 37.76,25.18 37.26,25.18 37.15,25.07 37.15,23.92 37.21,23.86 C204.1 | JP201.4 25.4,4.5 25.8,4.9 31,4.9 v31.7,4.2
  Top 0.3: R201.P$2 39.91,25.38 v39.92,25.37 40.23,25.06 IC201.1
  Bottom 0.2: v31.7,4.2 31.7,5 31.3,5.4 31.3,8.5 30.8,9 30.8,12.9 30.1,13.6 30.1,15.6 29.4,16.3 29.4,20.2 30.1,20.9 31.8,20.9 35.4,24.5 36.6,24.5 37.4,23.7 39.3,23.7 39.92,24.32 v39.92,25.37
REF3  (via drill 0.3 pad 0.8)
  Top 0.3: IC201.2 42.31,24.4 41.61,23.7 39.7,23.7 39.33,23.33 C202.1 39.1,23.47 v39.1,24.5 38.04,24.5 R201.P$1
  Bottom 0.2: JP201.6 30.48,4.12 29.6,5 29.6,8.2 30.4,9 30.4,12.7 29.7,13.4 29.7,15.4 29,16.1 29,20.3 30,21.3 31.6,21.3 32.9,22.6 35.23,24.9 36.73,24.9 37.13,24.5 v39.1,24.5
REFR1  (via drill 0.3 pad 0.8)
  Top 0.3: R203.P$2 38.56,29.06 39.1,29.6 v39.6,29.6 | IC201.28 41.06,27.81 40.38,27.81 39.6,28.58 v39.6,29.6 | C205.1 39.58,31.58 39.58,31.27 39.79,31.06 39.79,29.79 v39.6,29.6
  Bottom 0.2: JP201.3 22.86,5.46 26.4,9 26.4,10.7 27,11.3 27,12.6 27.5,13.1 27.5,15.2 27.8,15.5 27.8,20.6 29.7,22.5 31,22.5 35.4,26.9 35.4,28.7 38.3,31.6 39.2,31.6 39.79,31 39.79,29.79 v39.6,29.6
REFR2  (via drill 0.3 pad 0.8)  (1 unrouted)
  Top 0.2: IC201.13 46.93,27.81 47.2,27.54 48,27.54 48.24,27.79 48.24,31.54 47.9,31.88 47.9,32 47.52,32.38 C203.1 47.6,32.53 v47.6,33.48 | 37.99,30.7 38.14,30.7 | 38.14,30.7 v39.03,30.7 | 38.14,30.7 38.2,30.76 v38.2,34.5
  Bottom 0.2: JP201.5 27.94,5.34 28.4,5.8 28.4,8.2 29.6,9.4 29.6,12.4 28.9,13.1 28.9,14.8 28.2,15.5 28.2,20.5 29.8,22.1 31.2,22.1 35.8,26.7 35.8,28.5 38,30.7 v39.03,30.7 | v38.2,34.5 46.6,34.5 47.4,33.7 v47.6,33.48
REFR3  (via drill 0.3 pad 0.8)
  Top 0.2: R203.P$1 37.36,28.26 | C201.1 37.21,31.36 37.16,31.32 37.16,28.46 37.36,28.26 | 37.36,28.26 37,27.91 v37,27.6
  Top 0.3: IC201.29 40.16,27.31 39.21,28.26 39.01,28.26 R203.P$1
  Bottom 0.2: JP201.7 31.22,0.7 29.8,0.7 29.2,1.3 29.2,8.4 30,9.2 30,12.5 29.3,13.2 29.3,15.1 28.6,15.8 28.6,20.4 29.9,21.7 31.4,21.7 36.2,26.5 36.2,27.4 36.4,27.6 v37,27.6
RESET  (via drill 0.3 pad 0.8)
  Top 0.2: 36.78,13.75 36.78,13.18 36.3,12.7 36.3,11.49 35.82,11.01 IC101.52 34.11,11.01 33.7,10.6 | v33.7,10.1 33.7,10.6 | 33.7,10.6 33.4,10.9 33.4,11.7 31.6,13.5 28.1,13.5 25,16.6 25,16.8 v24.3,17.5 | R103.P$2 20,7.6 v20.7,8.3
  Bottom 0.2: TP3.TP 33.7,11.47 v33.7,10.1 | v24.3,17.5 25,16.8 25,14 20.7,9.6 v20.7,8.3
RS485+
  Top 0.2: SV101.6 4.83,19.3 7.1,19.3 9.2,17.2 12.5,17.2 13.1,17.8 13.1,18.5 13.46,18.86 IC104.6
RS485-
  Top 0.2: SV101.7 7.4,21.81 7.4,19.6 9.4,17.6 12.3,17.6 12.7,18 12.7,18.5 12.19,18.99 IC104.7
RS485_DIR  (via drill 0.3 pad 0.8)
  Top 0.2: IC101.47 31.93,9.43 33,10.5 33,11.6 31.5,13.1 27.87,13.1 24.57,16.4 v24.3,16.4 | IC104.3 13.5,14.61 13.5,15.5 13.2,15.8 12.95,15.8 | 12.95,15.8 12.5,15.8 12.2,15.5 IC104.2 | v12.96,16.43 12.96,15.8 12.95,15.8
  Bottom 0.2: v24.3,16.4 23.8,16.4 23,15.6 17.7,15.6 15.98,17.32 13.85,17.32 v12.96,16.43
RS485_RX  (via drill 0.3 pad 0.8)
  Top 0.2: IC104.1 v10.92,16 | v24.32,14.3 24.79,13.83 26.57,13.83 27.7,12.7 31.4,12.7 32.6,11.5 32.6,10.6 31.7,9.7 31.2,9.7 30.93,9.43 IC101.45
  Bottom 0.2: v24.32,14.3 23.52,13.48 22.65,12.61 21.54,12.61 20.75,12.89 13.9,12.89 v10.92,16 10.92,17.48 6.9,21.5 5.9,21.5 5.1,22.3 5.1,24.11 SV101.10
RS485_TX  (via drill 0.3 pad 0.8)
  Top 0.2: v14.11,16.36 14.11,15.87 14.53,15.45 14.53,14.77 IC104.4 | IC101.44 30.43,9.63 30.9,10.1 31.6,10.1 32.2,10.7 32.2,11.3 31.2,12.3 27.6,12.3 26.6,13.3 23.87,13.3 23.6,13.57 23.6,14.7 v24.3,15.4
  Bottom 0.2: v24.3,15.4 23.3,14.4 21.8,14.4 20.99,13.72 15.22,13.72 14.1,14.84 | SV101.9 7.4,24.35 7.4,21.9 11.5,17.8 11.5,16.5 12.9,15.1 13.22,14.85 14.1,14.84 | v14.11,16.36 v14.1,16.35 14.1,14.84
SG_TST  (via drill 0.3 pad 0.8)
  Top 0.2: IC301.27 57.97,26.81 v58.32,26.46 | IC101.43 29.93,10.23 30.7,11 v31.5,11 | R301.1 40.77,7.2 40.6,7.2 v40.1,6.7 | v49.8,8.5 v47.1,8.5
  Bottom 0.2: v31.5,11 31.5,9.1 32.2,8.4 38.4,8.4 v40.1,6.7 46.4,6.7 47.1,7.4 v47.1,8.5 | v58.32,26.46 57.46,25.6 54.6,25.6 54.2,25.2 54.2,24.1 49.5,19.4 49.5,8.8 v49.8,8.5
SPI0_MISO  (via drill 0.3 pad 0.8)
  Top 0.2: IC101.79 31.9,23.5 31.8,23.4 26.8,23.4 24.8,21.4 24.1,21.4 23.8,21.1 v23.8,19.1 | IC103.2 v12.19,25.79 v12.2,25.8
  Bottom 0.2: v23.8,19.1 23.1,18.4 23.1,17.3 22.3,16.5 18.23,16.5 15.3,19.3 15.31,20.19 12.2,23.3 v12.2,25.8
SPI0_MOSI  (via drill 0.3 pad 0.8)
  Top 0.2: IC101.78 32.43,23.53 31.9,23 26.9,23 v24.5,20.6 | IC103.5 14.7,29 15.6,29 16.5,28.1 v17.6,28.1
  Bottom 0.2: v24.5,20.6 24,20.1 23,20.1 20.35,22.75 19.05,22.75 18.4,23.4 18.4,27.3 v17.6,28.1
SPI0_SCK
  Top 0.2: IC101.77 32.93,25.07 32.7,25.3 32.1,25.3 29.4,28 21,28 20.7,28.3 19.1,28.3 18.2,27.4 14.7,27.4 13.46,28.64 IC103.6
SPI1_MISO  (via drill 0.3 pad 0.8)
  Top 0.2: IC201.12 46.84,27.31 47.28,26.87 v47.83,26.87 | 50.81,28.95 v50.65,28.95 51.16,28.95 51.25,28.86 52.24,28.86 IC301.10 | IC101.63 35.88,16.51 36.07,16.7 36.07,18.17 36.5,18.6 v40.1,18.6
  Bottom 0.2: v40.1,18.6 41,18.6 41.3,18.9 41.3,20.1 42.6,21.4 46.3,21.4 46.7,21.8 46.7,23.8 47,24.1 47,26 47.83,26.83 v47.83,26.87 48.47,26.87 49.4,27.8 49.4,28.2 50.1,28.9 50.6,28.9 v50.65,28.95
SPI1_MOSI  (via drill 0.3 pad 0.8)
  Top 0.2: IC301.11 51.06,28.31 50.79,28.04 v50.27,28.04 | IC201.10 47.21,26.31 v47.84,25.68 | IC101.62 36.13,16.01 36.43,16.31 36.43,17.91 36.73,18.2 39.3,18.2 v40.3,17.2
  Bottom 0.2: v40.3,17.2 41.7,18.6 41.7,19.9 42.8,21 46.5,21 47.1,21.6 47.1,23.6 47.84,24.34 v47.84,25.68 47.91,25.68 v50.27,28.04
SPI1_SCK  (via drill 0.3 pad 0.8)
  Top 0.2: IC301.12 51.23,27.81 50.88,27.46 50.64,27.46 v50.2,27.02 | IC101.59 34.5,14.5 34.3,14.7 34.3,16.7 33,18 v33,19.4 | IC201.8 45.31,24.71 45.3,24.7 45.6,24.7 46.5,23.8 v48.7,23.8
  Bottom 0.2: v33,19.4 33.4,19 33.7,19 36.7,16 41.1,16 42.5,17.4 42.5,19.5 43.2,20.2 46.8,20.2 48.7,22.1 v48.7,23.8 50.2,25.3 v50.2,27.02
SRA  (via drill 0.3 pad 0.8, 0.5 pad 1)
  Top 0.3: IC301.8 52.99,31.01 52,32 52,33.5 v52.7,34.2
  Top 0.7: v61.38,50.8 v61.38,50.79 T301.1 v65.88,50.79 | v61.38,36.82 T302.1 65.91,36.82 v65.92,36.81 | v67.37,43.22 66.36,43.22 R303.2 66.36,42.12 v67.36,42.12 | v67.35,40.66 66.34,40.66 R304.2 66.36,39.59 v67.36,39.59
  Bottom 0.3: v52.7,34.2 53.5,33.4 54.1,33.4 54.5,33.8 56.6,33.8 56.9,33.5 58.1,33.5 59.9,35.3 59.9,37.56 62.69,39.59 v67.36,39.59
  pour Route15: 60.5,51.5 68.5,51.5 68.5,39 68.5,35.5 60.5,35.5 60.5,38.5 61.5,38.5 61.5,48 60.5,48
SRB  (via drill 0.3 pad 0.8, 0.5 pad 1)
  Top 0.3: IC301.17 52.99,24.19 52,23.2 52,20.3 53,19.3 v55.5,19.3
  Top 0.7: v61.47,23.34 62.06,23.35 T303.1 64.63,23.35 v65.92,23.35 | v67.37,15.79 66.36,15.79 R305.2 66.36,14.69 v67.37,14.69 | v67.37,12.86 66.35,12.86 R306.2 66.36,11.77 v67.38,11.77 | v61.35,9.39 63.11,9.38 T304.1 64.62,9.39 v65.91,9.39
  Bottom 0.3: v67.37,15.79 61.51,15.79 60.8,16.5 56.3,16.5 55.5,17.3 v55.5,19.3
  pour Route15: 60.5,24.5 68.5,24.5 68.5,8 60.5,8 60.5,11.5 61.5,11.5 61.5,21 60.5,21
STEP1  (via drill 0.3 pad 0.8)
  Top 0.2: IC301.31 57.83,28.81 58.01,28.98 58.01,29.89 v57.6,30.3 | JP205.2 43.13,44.5 41.2,44.5 40.7,44 40.7,41 41.2,40.5 45.2,40.5 v45.5,40.2
  Bottom 0.2: v45.5,40.2 45.5,38.8 52.6,31.7 54.1,31.7 55.5,30.3 v57.6,30.3
STEP1_429  (via drill 0.3 pad 0.8)
  Top 0.2: IC201.15 46.69,28.81 47.5,29.62 v47.5,31.3
  Bottom 0.2: v47.5,31.3 48.7,32.5 48.7,33.8 47.2,35.3 43.8,35.3 41.1,38 41.1,41.6 41.4,41.9 JP205.3
STEP1_EXT
  Top 0.2: JP203.2 45.72,47.62 45.1,47 JP205.1
STEP2  (via drill 0.3 pad 0.8)
  Top 0.2: IC201.18 44.81,30.6 v45.51,31.3
  Bottom 0.2: JP204.2 50.8,5 48.7,7.1 48.7,19.6 53.4,24.3 53.4,25.5 52.5,26.4 52.5,29.6 50.3,31.8 49,31.8 47.7,30.5 46.3,30.5 45.91,30.89 v45.51,31.3
STEP3  (via drill 0.3 pad 0.8)
  Top 0.2: IC201.19 44.31,30.65 44.8,31.14 44.8,33.14 v45.1,33.44 v45.1,33.45
  Bottom 0.2: JP202.2 40.64,5.04 41.7,6.1 46.6,6.1 47.9,7.4 47.9,19.8 52.6,24.5 52.6,25.2 51.7,26.1 51.7,29.4 50.1,31 49.2,31 47.9,29.7 45.47,29.7 44.31,30.86 44.31,32.66 v45.1,33.45
SWCLK  (via drill 0.3 pad 0.8)
  Top 0.2: 18.76,8.39 18.75,8.4 R103.P$3 19.79,8.4 21.14,9.75 22.21,9.75 23.76,11.3 v23.8,11.3 24.37,10.73 25.1,10.73 25.58,10.25 25.58,9.73 25.43,9.58 IC101.34 | v31.7,17.7 29.5,17.7 28.6,16.8 26.1,16.8 v25.4,17.5
  Bottom 0.2: v23.8,11.3 23.8,12 25.4,13.6 v25.4,17.5 | TP1.TP 46.31,14.52 45.68,13.89 45.67,13.9 40.4,13.9 39.9,14.4 36.4,14.4 33.1,17.7 v31.7,17.7
SWDIO  (via drill 0.3 pad 0.8)
  Top 0.2: 18.8,9.27 18.73,9.2 R103.P$4 20,9.2 20.99,10.19 22.09,10.19 23,11.1 23,11.5 24.01,12.51 26.1,12.51 27.2,11.41 v27.2,10.5 26.93,10.23 IC101.37 | v30.1,16.6 29.2,15.7 29.2,15.4 v28.2,14.4
  Bottom 0.2: v27.2,10.5 27.5,10.8 27.5,12.4 28.2,13.1 v28.2,14.4 | TP2.TP 43.18,10.88 43.18,10.03 42.69,9.55 38.99,9.55 38.35,8.9 33.4,8.9 32.3,10 32.3,11.8 32.2,11.9 32.2,15.4 31,16.6 v30.1,16.6
USB_VBUS  (via drill 0.3 pad 0.8)
  Top 0.3: IC101.13 18.38,16.51 | 18.38,16.51 18,16.64 15.88,16.64 14.5,18.14 v14.43,18.21 | 18.38,16.51 18.38,16.13 C119.1
  Top 0.5: D101.5 12.23,39.38 12.92,39.38 13.44,39.91 13.44,40.05 13.46,40.07 v13.46,40.9 | D401.2 17.53,38.35 17.27,38.61 16.76,38.61 | 16.76,38.61 v16.17,38.61 | R104.1 17.06,38.9 16.76,38.61 | v13.41,43.38 13.54,43.38 13.4,43.52 L102.2
  Bottom 0.5: v13.46,40.9 13.46,43.34 v13.41,43.38 | v16.17,38.61 16.17,39.61 14.88,40.9 v13.46,40.9 | 14.48,18.16 12.29,18.16 9.67,21.03 9.67,40.41 10.29,40.9 v13.46,40.9 | 14.5,18.16 14.48,18.16 | 14.48,18.16 v14.43,18.21
V33
  Top 0.3: IC201.22 42.81,31.57 43,31.76 43,31.99 C207.1
V+  (via drill 0.3 pad 0.8, 0.5 pad 1)
  Top 0.2: R113.2 32.65,42.66 L401.1
  Top 0.3: IC301.25 57.83,25.81 58.05,25.59 58.57,25.59 59.04,26.06 59.3,26.06 C302.1
  Top 0.5: L401.1 32.68,41.24 32.68,40.51 32.92,40.27 C401.1 v34.33,39.69 | v34.33,39.69 | C302.1 C301.1 59.75,25.11 v60.9,25.1
  Top 0.7: C307.1 60.81,47.1 | 60.81,47.1 v60.81,45.93 | 60.81,47.1 60.83,47.11 | 60.83,47.11 60.83,47.82 60.21,48.44 v59.63,48.44 | 60.83,47.11 60.83,46.99 T301.4 | v65.93,33.03 65.87,33.02 T302.4 61.63,33.02 v61.4,33.02 | v59.59,21.04 60.44,21.04 60.92,20.56 C306.1 | T303.4 C306.1 | 61.36,5.72 v61.34,5.57 62.93,5.57 64.21,5.56 | T304.4 65.11,5.59 v65.88,5.59 | C306.1 60.92,18.32
  other vias: 60.9,18.3
  pour Route15 (rank 2): 28,54.5 81,54.5 arc-90 84.5,51 84.5,4 arc-90 81,0.5 56.5,0.5 56.5,33 49,33 49,38.5 28,38.5

## Text on the board
Top: 1 | Top Layer 1
Layer2: 2 | Inner Layer 2
Route15: 3 | Inner Layer 3
Bottom: 4 | V21-150227 | Bottom Layer 4
Dimension: TMCM-1110_V21 27.02.2015
tPlace: S/D In | GPIO | -1- | -2- | -3- | 1-2 External | 2-3 TMC429 | 1A/2.8A | A1 | A2 | B1 | B2 | Power | Silksreen Top | Led 1 | Led 2 | PosComp | 1A/2.8A | RS485/CAN | Interrupt | stallGuard2 | GND | L0 | R0 | L1 | R1 | L2 | R2 | S/D Out 2 | S/D Out 1 | TMCM-1110 V2.1
bPlace: Silksreen Bottom
tStop: Solder Mask Top
bStop: Solder Mask Bottom
tCream: Paste Mask Top
bCream: Paste Mask Bottom
tDocu: Assembly Top
bDocu: Assembly Bottom
DrillLegend: Drill Drawing